# Altium project PCB_Project_IMX7.PrjPCB (part 9 of 9)
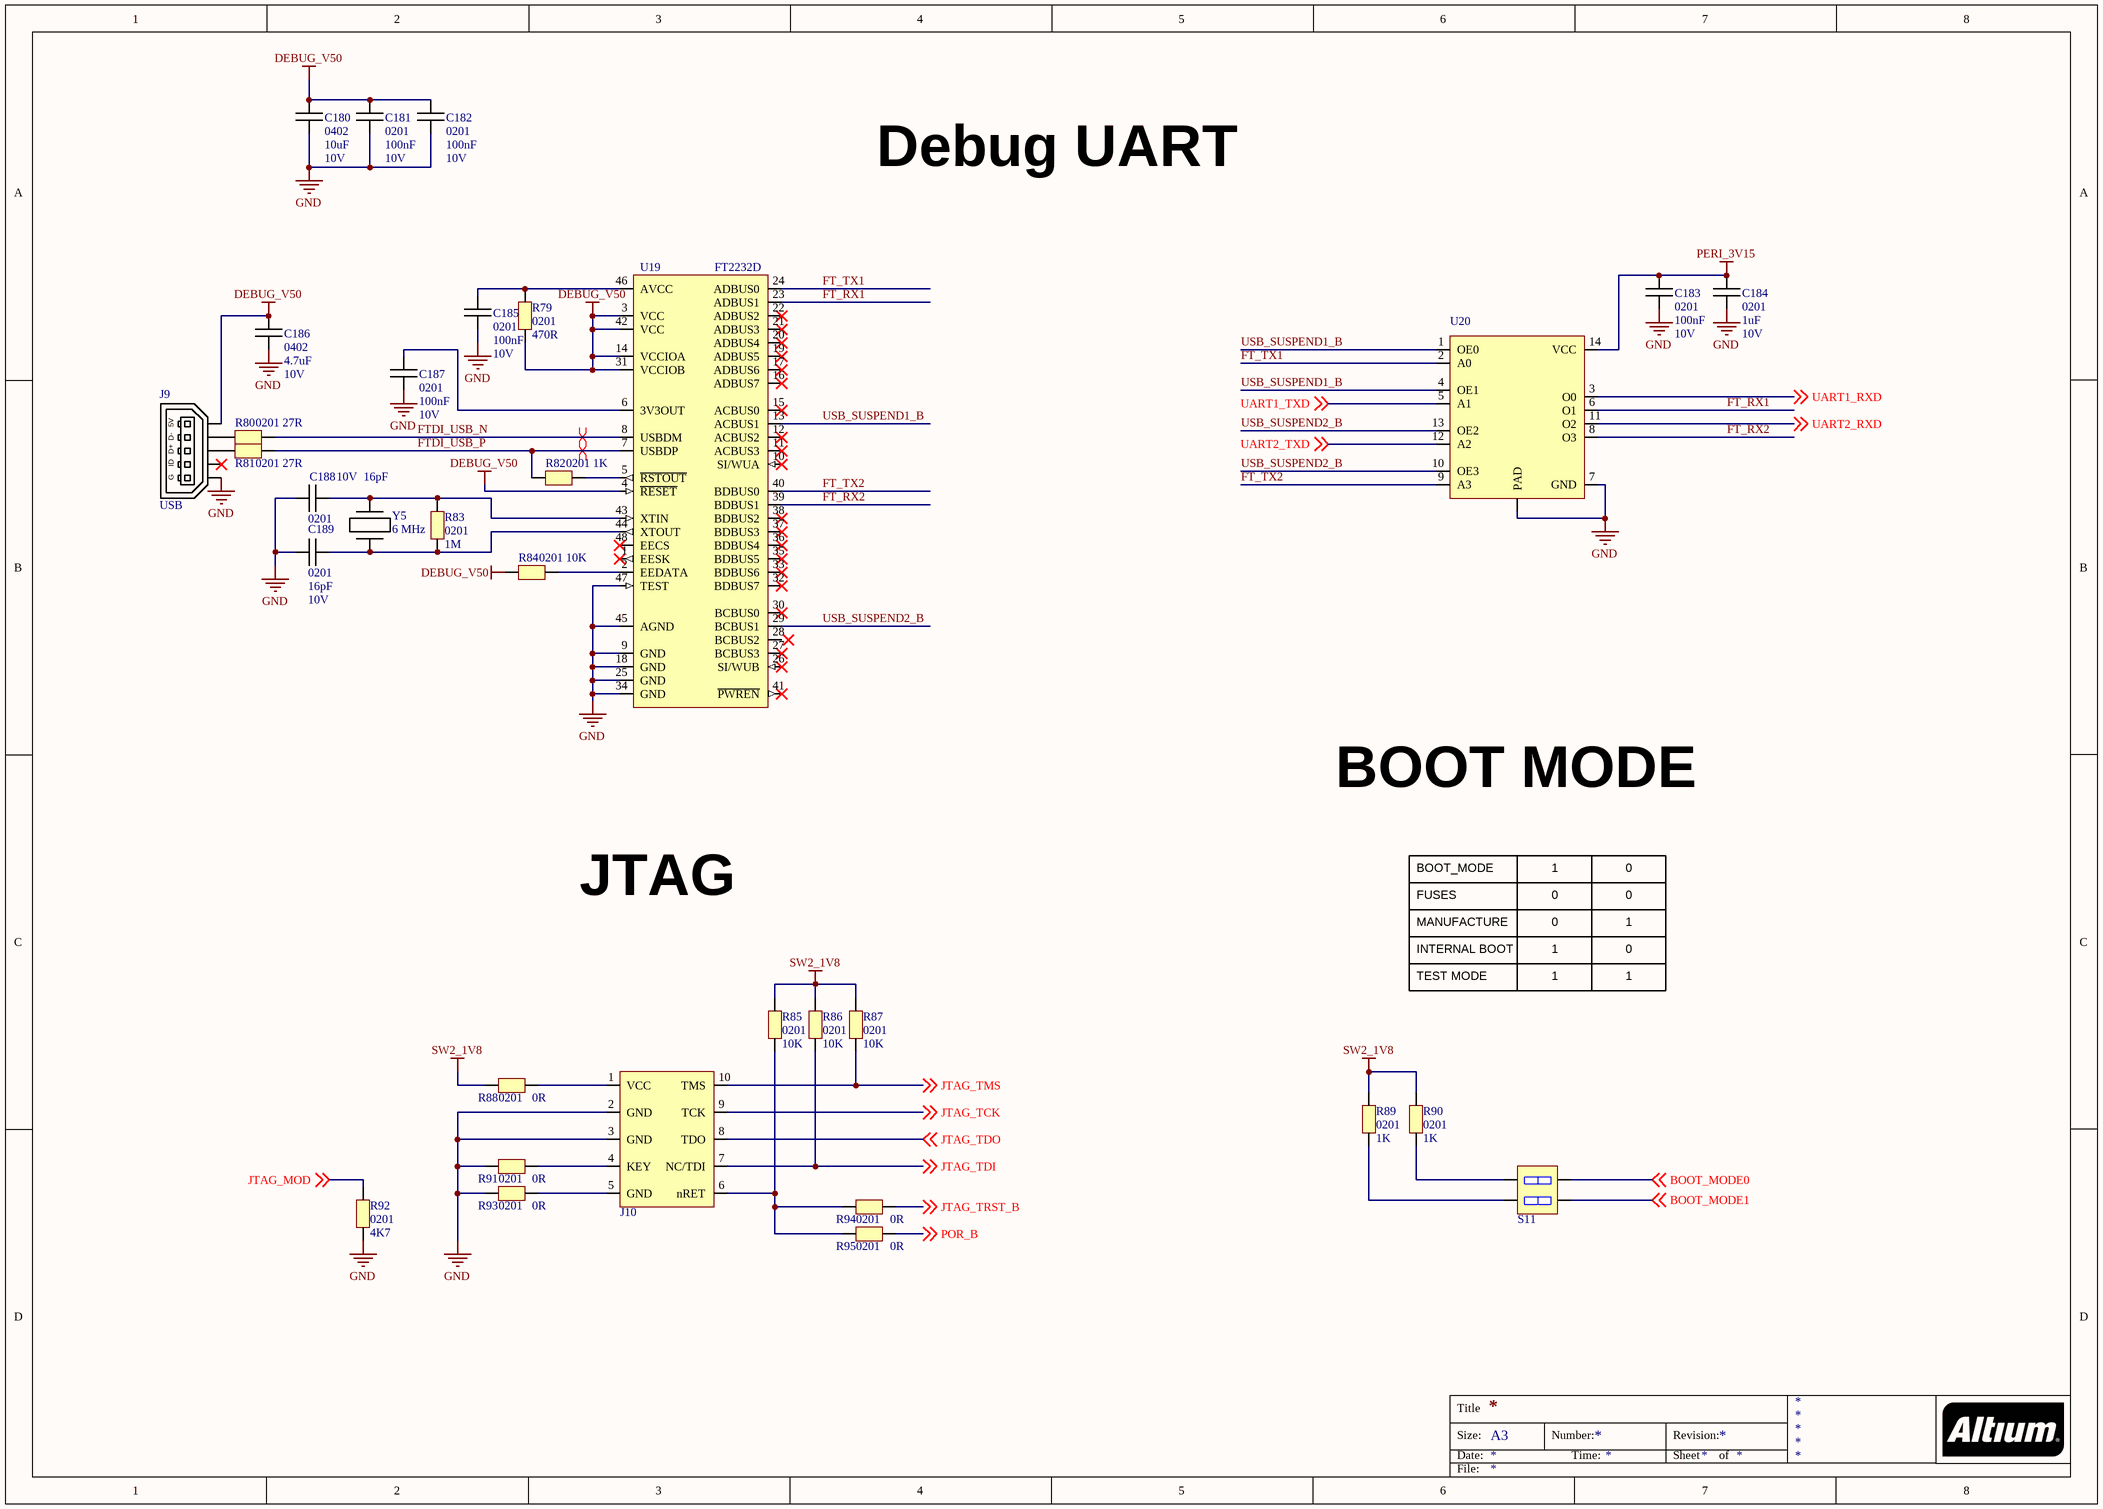
[diagram p12: IMX7S_DEBUG.SchDoc]

## Nets that join several sheets
DDR_VREF: IMX7S_PMIC (R34.2 R35.1), IMX7S_MEMORY (6 pins)
GND: IMX7S_PMIC (39 pins), IMX7S_CPU_POWER (123 pins), IMX7S_CPU_INTERFACES_1 (17 pins), IMX7S_CPU_INTERFACES_2 (11 pins), IMX7S_MEMORY (94 pins), IMX7S_WIRELESS (37 pins), IMX7S_CONNECTORS_&_IHM (34 pins), IMX7S_SENSORS_&_EXTERNAL_INTERFACES (43 pins), IMX7S_POWER (24 pins), IMX7S_DEBUG (24 pins)
NVCC_3V15: IMX7S_PMIC (C125.2 C135.2 U5.32 U5.47), IMX7S_CPU_INTERFACES_1 (12 pins), IMX7S_CPU_INTERFACES_2 (10 pins), IMX7S_MEMORY (7 pins), IMX7S_WIRELESS (7 pins)
NVCC_DRAM: IMX7S_PMIC (R34.1 R36.2), IMX7S_MEMORY (66 pins)
NVCC_SD2: IMX7S_PMIC (C122.2 U5.33), IMX7S_CPU_INTERFACES_1 (C21.2 U2.L9)
PERI_3V15: IMX7S_MEMORY (6 pins), IMX7S_WIRELESS (L6.2), IMX7S_CONNECTORS_&_IHM (41 pins), IMX7S_SENSORS_&_EXTERNAL_INTERFACES (35 pins), IMX7S_POWER (C167.1 L9.2 R63.2 TP6.1), IMX7S_DEBUG (C183.2 C184.2 U20.14)
PMIC_PWR: IMX7S_PMIC (17 pins), IMX7S_WIRELESS (C152.2 U14.30), IMX7S_POWER (C166.1 U17.2 U17.3)
SW2_1V8: IMX7S_PMIC (9 pins), IMX7S_CPU_POWER (C58.2 L1.1 U2.V9), IMX7S_MEMORY (9 pins), IMX7S_CONNECTORS_&_IHM (C1.2 U1.20), IMX7S_DEBUG (6 pins)
USB_OTG_VBUS: IMX7S_CPU_INTERFACES_2 (C27.2 U2.C9), IMX7S_POWER (10 pins)
VDD_ARM_SOC_IN: IMX7S_PMIC (R37.1 R38.1 U5.6), IMX7S_CPU_POWER (50 pins)
VDDA_1P8_IN: IMX7S_PMIC (R39.1), IMX7S_CPU_POWER (7 pins)
VLDO3_1V8: IMX7S_PMIC (C112.2 U5.20), IMX7S_CPU_POWER (R28.1 R29.1)
VSNVS: IMX7S_PMIC (C115.2 R42.2 U5.34), IMX7S_CPU_POWER (R27.1)
AUDIO_SAI1_MCLK: IMX7S_CPU_INTERFACES_1 (U2.D3), IMX7S_CONNECTORS_&_IHM (U1.13)
AUDIO_SAI1_RXD: IMX7S_CPU_INTERFACES_1 (U2.F3), IMX7S_CONNECTORS_&_IHM (U1.16)
AUDIO_SAI1_TXC: IMX7S_CPU_INTERFACES_1 (U2.F4), IMX7S_CONNECTORS_&_IHM (U1.15)
AUDIO_SAI1_TXD: IMX7S_CPU_INTERFACES_1 (U2.G5), IMX7S_CONNECTORS_&_IHM (U1.17)
AUDIO_SAI1_TXFS: IMX7S_CPU_INTERFACES_1 (U2.F5), IMX7S_CONNECTORS_&_IHM (U1.14)
BC3770_INT_B: IMX7S_CPU_INTERFACES_1 (U2.G2), IMX7S_POWER (R76.1 U18.B5)
BC3770_SHDN_B: IMX7S_CPU_INTERFACES_1 (U2.G1), IMX7S_POWER (U18.D3)
BNO055_BL_IND: IMX7S_CPU_INTERFACES_1 (U2.P27), IMX7S_SENSORS_&_EXTERNAL_INTERFACES (U13.10)
BNO055_INT: IMX7S_CPU_INTERFACES_1 (U2.T28), IMX7S_SENSORS_&_EXTERNAL_INTERFACES (U13.14)
BNO055_RST_B: IMX7S_CPU_INTERFACES_1 (U2.N28), IMX7S_SENSORS_&_EXTERNAL_INTERFACES (R49.1 U13.11)
BOOT_MODE0: IMX7S_CPU_INTERFACES_1 (U2.Y1), IMX7S_DEBUG (S11.4)
BOOT_MODE1: IMX7S_CPU_INTERFACES_1 (U2.Y2), IMX7S_DEBUG (S11.3)
BT_HOST_WAKE: IMX7S_CPU_INTERFACES_1 (U2.E1), IMX7S_WIRELESS (U14.38)
BT_REG_ON: IMX7S_CPU_INTERFACES_1 (U2.G3), IMX7S_WIRELESS (U14.14)
CAN_INT: IMX7S_CPU_INTERFACES_1 (U2.T26), IMX7S_SENSORS_&_EXTERNAL_INTERFACES (U9.12)
CAN_SPI4_MISO: IMX7S_CPU_INTERFACES_1 (U2.D20), IMX7S_CONNECTORS_&_IHM (MIKROBUS_4.5), IMX7S_SENSORS_&_EXTERNAL_INTERFACES (U9.14)
CAN_SPI4_MOSI: IMX7S_CPU_INTERFACES_1 (U2.G28), IMX7S_CONNECTORS_&_IHM (MIKROBUS_4.6), IMX7S_SENSORS_&_EXTERNAL_INTERFACES (U9.15)
CAN_SPI4_SCLK: IMX7S_CPU_INTERFACES_1 (U2.F25), IMX7S_CONNECTORS_&_IHM (MIKROBUS_4.4), IMX7S_SENSORS_&_EXTERNAL_INTERFACES (U9.13)
CAN_SPI4_SS: IMX7S_CPU_INTERFACES_1 (U2.N23), IMX7S_SENSORS_&_EXTERNAL_INTERFACES (U9.16)
CHARGE_EN_B: IMX7S_CPU_INTERFACES_1 (U2.F2), IMX7S_POWER (U18.D2)
CSI_CLK_N: IMX7S_CPU_INTERFACES_2 (U2.B16), IMX7S_CONNECTORS_&_IHM (J1.8)
CSI_CLK_P: IMX7S_CPU_INTERFACES_2 (U2.A16), IMX7S_CONNECTORS_&_IHM (J1.9)
CSI_D0_N: IMX7S_CPU_INTERFACES_2 (U2.B18), IMX7S_CONNECTORS_&_IHM (J1.2)
CSI_D0_P: IMX7S_CPU_INTERFACES_2 (U2.A18), IMX7S_CONNECTORS_&_IHM (J1.3)
CSI_D1_N: IMX7S_CPU_INTERFACES_2 (U2.B15), IMX7S_CONNECTORS_&_IHM (J1.5)
CSI_D1_P: IMX7S_CPU_INTERFACES_2 (U2.B14), IMX7S_CONNECTORS_&_IHM (J1.6)
CSI_GPIO0: IMX7S_CPU_INTERFACES_2 (U2.Y6), IMX7S_CONNECTORS_&_IHM (J1.11)
CSI_GPIO1: IMX7S_CPU_INTERFACES_2 (U2.Y5), IMX7S_CONNECTORS_&_IHM (J1.12)
DSI_CLK_N: IMX7S_CPU_INTERFACES_2 (U2.B24), IMX7S_CONNECTORS_&_IHM (J2.5)
DSI_CLK_P: IMX7S_CPU_INTERFACES_2 (U2.A24), IMX7S_CONNECTORS_&_IHM (J2.6)
DSI_D0_N: IMX7S_CPU_INTERFACES_2 (U2.B25), IMX7S_CONNECTORS_&_IHM (J2.8)
DSI_D0_P: IMX7S_CPU_INTERFACES_2 (U2.A25), IMX7S_CONNECTORS_&_IHM (J2.9)
DSI_D1_N: IMX7S_CPU_INTERFACES_2 (U2.A22), IMX7S_CONNECTORS_&_IHM (J2.2)
DSI_D1_P: IMX7S_CPU_INTERFACES_2 (U2.B22), IMX7S_CONNECTORS_&_IHM (J2.3)
I2C1_SCL: IMX7S_PMIC (U5.46), IMX7S_CPU_INTERFACES_2 (U2.N4), IMX7S_POWER (R75.1 U18.A4)
I2C1_SDA: IMX7S_PMIC (U5.45), IMX7S_CPU_INTERFACES_2 (U2.N5), IMX7S_POWER (R74.1 U18.A5)
I2C2_SCL: IMX7S_CPU_INTERFACES_2 (U2.N6), IMX7S_CONNECTORS_&_IHM (J1.13 J2.11)
I2C2_SDA: IMX7S_CPU_INTERFACES_2 (U2.N7), IMX7S_CONNECTORS_&_IHM (J1.14 J2.12)
I2C3_SCL: IMX7S_CPU_INTERFACES_2 (R19.1 U2.T6), IMX7S_CONNECTORS_&_IHM (MIKROBUS_1.12 MIKROBUS_2.12 MIKROBUS_3.12 MIKROBUS_4.12), IMX7S_SENSORS_&_EXTERNAL_INTERFACES (6 pins)
I2C3_SDA: IMX7S_CPU_INTERFACES_2 (R20.1 U2.T7), IMX7S_CONNECTORS_&_IHM (MIKROBUS_1.11 MIKROBUS_2.11 MIKROBUS_3.11 MIKROBUS_4.11), IMX7S_SENSORS_&_EXTERNAL_INTERFACES (6 pins)
I2C4_SCL: IMX7S_CPU_INTERFACES_2 (R21.1 U2.T5), IMX7S_CONNECTORS_&_IHM (U1.19)
I2C4_SDA: IMX7S_CPU_INTERFACES_2 (R22.1 U2.T4), IMX7S_CONNECTORS_&_IHM (U1.18)
JTAG_MOD: IMX7S_CPU_INTERFACES_1 (U2.AB1), IMX7S_DEBUG (R92.1)
JTAG_TCK: IMX7S_CPU_INTERFACES_1 (U2.AD1), IMX7S_DEBUG (J10.9)
JTAG_TDI: IMX7S_CPU_INTERFACES_1 (U2.AC2), IMX7S_DEBUG (J10.7 R86.2)
JTAG_TDO: IMX7S_CPU_INTERFACES_1 (U2.AE1), IMX7S_DEBUG (J10.8)
JTAG_TMS: IMX7S_CPU_INTERFACES_1 (U2.AD2), IMX7S_DEBUG (J10.10 R87.2)
JTAG_TRST_B: IMX7S_CPU_INTERFACES_1 (U2.AB2), IMX7S_DEBUG (R94.1)
MKBUS1_ADC_IN: IMX7S_CONNECTORS_&_IHM (MIKROBUS_1.1), IMX7S_SENSORS_&_EXTERNAL_INTERFACES (U6.1)
MKBUS1_INT: IMX7S_CPU_INTERFACES_1 (U2.D13), IMX7S_CONNECTORS_&_IHM (MIKROBUS_1.15)
MKBUS1_PWM: IMX7S_CPU_INTERFACES_1 (U2.E16), IMX7S_CPU_INTERFACES_2 (U2.AB3), IMX7S_CONNECTORS_&_IHM (MIKROBUS_1.16)
MKBUS1_RST: IMX7S_CPU_INTERFACES_2 (U2.AC6), IMX7S_CONNECTORS_&_IHM (MIKROBUS_1.2)
MKBUS2_ADC_IN: IMX7S_CONNECTORS_&_IHM (MIKROBUS_2.1), IMX7S_SENSORS_&_EXTERNAL_INTERFACES (U6.2)
MKBUS2_INT: IMX7S_CPU_INTERFACES_2 (U2.Y4), IMX7S_CONNECTORS_&_IHM (MIKROBUS_2.15)
MKBUS2_PWM: IMX7S_CPU_INTERFACES_2 (U2.AB4), IMX7S_CONNECTORS_&_IHM (MIKROBUS_2.16)
MKBUS2_RST: IMX7S_CPU_INTERFACES_2 (U2.AC5), IMX7S_CONNECTORS_&_IHM (MIKROBUS_2.2)
MKBUS3_ADC_IN: IMX7S_CONNECTORS_&_IHM (MIKROBUS_3.1), IMX7S_SENSORS_&_EXTERNAL_INTERFACES (U6.3)
MKBUS3_INT: IMX7S_CPU_INTERFACES_2 (U2.V6), IMX7S_CONNECTORS_&_IHM (MIKROBUS_3.15)
MKBUS3_PWM: IMX7S_CPU_INTERFACES_2 (U2.AB5), IMX7S_CONNECTORS_&_IHM (MIKROBUS_3.16)
MKBUS3_RST: IMX7S_CPU_INTERFACES_2 (U2.AC4), IMX7S_CONNECTORS_&_IHM (MIKROBUS_3.2)
MKBUS4_ADC_IN: IMX7S_CONNECTORS_&_IHM (MIKROBUS_4.1), IMX7S_SENSORS_&_EXTERNAL_INTERFACES (U6.4)
MKBUS4_INT: IMX7S_CPU_INTERFACES_2 (U2.V7), IMX7S_CONNECTORS_&_IHM (MIKROBUS_4.15)
MKBUS4_PWM: IMX7S_CPU_INTERFACES_2 (U2.AB6), IMX7S_CONNECTORS_&_IHM (MIKROBUS_4.16)
MKBUS4_RST: IMX7S_CPU_INTERFACES_2 (U2.AC3), IMX7S_CONNECTORS_&_IHM (MIKROBUS_4.2)
MKBUS_ESPI3_MISO: IMX7S_CPU_INTERFACES_2 (U2.P2), IMX7S_CONNECTORS_&_IHM (MIKROBUS_1.5 MIKROBUS_2.5 MIKROBUS_3.5)
MKBUS_ESPI3_MOSI: IMX7S_CPU_INTERFACES_2 (U2.N1), IMX7S_CONNECTORS_&_IHM (MIKROBUS_1.6 MIKROBUS_2.6 MIKROBUS_3.6)
MKBUS_ESPI3_SCLK: IMX7S_CPU_INTERFACES_2 (U2.N2), IMX7S_CONNECTORS_&_IHM (MIKROBUS_1.4 MIKROBUS_2.4 MIKROBUS_3.4)
MKBUS_SPI4_SS0: IMX7S_CPU_INTERFACES_1 (U2.R27), IMX7S_CONNECTORS_&_IHM (MIKROBUS_4.3)
MKBUS_SS0: IMX7S_CPU_INTERFACES_2 (U2.N3), IMX7S_CONNECTORS_&_IHM (MIKROBUS_1.3)
MKBUS_SS1: IMX7S_CPU_INTERFACES_1 (U2.E11), IMX7S_CONNECTORS_&_IHM (MIKROBUS_2.3)
MKBUS_SS2: IMX7S_CPU_INTERFACES_1 (U2.F11), IMX7S_CONNECTORS_&_IHM (MIKROBUS_3.3)
MKBUS_UART5_RXD: IMX7S_CPU_INTERFACES_2 (U2.L3), IMX7S_CONNECTORS_&_IHM (MIKROBUS_1.14 MIKROBUS_2.14)
MKBUS_UART5_TXD: IMX7S_CPU_INTERFACES_2 (U2.K2), IMX7S_CONNECTORS_&_IHM (MIKROBUS_1.13 MIKROBUS_2.13)
MKBUS_UART7_RXD: IMX7S_CPU_INTERFACES_1 (U2.M26), IMX7S_CONNECTORS_&_IHM (MIKROBUS_3.14 MIKROBUS_4.14)
MKBUS_UART7_TXD: IMX7S_CPU_INTERFACES_1 (U2.L26), IMX7S_CONNECTORS_&_IHM (MIKROBUS_3.13 MIKROBUS_4.13)
MX7_ONOFF: IMX7S_CPU_INTERFACES_1 (U2.AD13), IMX7S_CONNECTORS_&_IHM (C5.2 S1.3 S1.4)
PCM_CLK: IMX7S_CPU_INTERFACES_1 (U2.D4), IMX7S_WIRELESS (U14.11)
PCM_IN: IMX7S_CPU_INTERFACES_1 (U2.D6), IMX7S_WIRELESS (U14.9)
PCM_OUT: IMX7S_CPU_INTERFACES_1 (U2.E6), IMX7S_WIRELESS (U14.10)
PCM_SYNC: IMX7S_CPU_INTERFACES_1 (U2.F6), IMX7S_WIRELESS (U14.8)
PMIC_INT_B: IMX7S_PMIC (R40.1 U5.1), IMX7S_CPU_INTERFACES_2 (U2.Y7)
PMIC_ON_REQ: IMX7S_PMIC (R42.1 R43.2 U5.48), IMX7S_CPU_INTERFACES_1 (U2.AE13)
PMIC_PWRON: IMX7S_PMIC (R43.1), IMX7S_CONNECTORS_&_IHM (C8.2 R2.1 R3.2)
PMIC_SD_VSEL: IMX7S_PMIC (U5.2), IMX7S_CPU_INTERFACES_1 (U2.E2)
POR_B: IMX7S_PMIC (R41.1 U5.3), IMX7S_CPU_INTERFACES_1 (U2.Y3), IMX7S_CPU_INTERFACES_2 (R24.1), IMX7S_CONNECTORS_&_IHM (R2.2), IMX7S_DEBUG (R95.1)
RST_SIGFOX: IMX7S_CPU_INTERFACES_1 (U2.N25), IMX7S_WIRELESS (U16.25)
SD1_CLK: IMX7S_CPU_INTERFACES_1 (U2.B3), IMX7S_WIRELESS (U14.20)
SD1_CMD: IMX7S_CPU_INTERFACES_1 (U2.A2), IMX7S_WIRELESS (R55.1 U14.22)
SD1_DATA0: IMX7S_CPU_INTERFACES_1 (U2.B4), IMX7S_WIRELESS (R51.1 U14.24)
SD1_DATA1: IMX7S_CPU_INTERFACES_1 (U2.A4), IMX7S_WIRELESS (R52.1 U14.26)
SD1_DATA2: IMX7S_CPU_INTERFACES_1 (U2.B2), IMX7S_WIRELESS (R53.1 U14.23)
SD1_DATA3: IMX7S_CPU_INTERFACES_1 (U2.B1), IMX7S_WIRELESS (R54.1 U14.25)
SD3_CLK: IMX7S_CPU_INTERFACES_1 (U2.J6), IMX7S_MEMORY (U4.M6)
SD3_CMD: IMX7S_CPU_INTERFACES_1 (U2.L4), IMX7S_MEMORY (U4.M5)
SD3_DATA0: IMX7S_CPU_INTERFACES_1 (U2.G6), IMX7S_MEMORY (U4.A3)
SD3_DATA1: IMX7S_CPU_INTERFACES_1 (U2.G7), IMX7S_MEMORY (U4.A4)
SD3_DATA2: IMX7S_CPU_INTERFACES_1 (U2.L7), IMX7S_MEMORY (U4.A5)
SD3_DATA3: IMX7S_CPU_INTERFACES_1 (U2.L6), IMX7S_MEMORY (U4.B2)
SD3_DATA4: IMX7S_CPU_INTERFACES_1 (U2.L5), IMX7S_MEMORY (U4.B3)
SD3_DATA5: IMX7S_CPU_INTERFACES_1 (U2.J7), IMX7S_MEMORY (U4.B4)
SD3_DATA6: IMX7S_CPU_INTERFACES_1 (U2.J5), IMX7S_MEMORY (U4.B5)
SD3_DATA7: IMX7S_CPU_INTERFACES_1 (U2.J4), IMX7S_MEMORY (U4.B6)
SD3_RESET_B: IMX7S_CPU_INTERFACES_1 (U2.J2), IMX7S_MEMORY (U4.K5)
SD3_STROBE: IMX7S_CPU_INTERFACES_1 (U2.J1), IMX7S_MEMORY (U4.H5)
UART1_RXD: IMX7S_CPU_INTERFACES_2 (U2.T1), IMX7S_DEBUG (U20.3)
UART1_TXD: IMX7S_CPU_INTERFACES_2 (U2.V1), IMX7S_DEBUG (U20.5)
UART2_RXD: IMX7S_CPU_INTERFACES_2 (U2.T2), IMX7S_DEBUG (U20.11)
UART2_TXD: IMX7S_CPU_INTERFACES_2 (U2.T3), IMX7S_DEBUG (U20.12)
UART3_CTS: IMX7S_CPU_INTERFACES_2 (U2.V3), IMX7S_WIRELESS (U14.4)
UART3_RTS: IMX7S_CPU_INTERFACES_2 (U2.W2), IMX7S_WIRELESS (U14.5)
UART3_RXD: IMX7S_CPU_INTERFACES_2 (U2.V2), IMX7S_WIRELESS (U14.3)
UART3_TXD: IMX7S_CPU_INTERFACES_2 (U2.U3), IMX7S_WIRELESS (U14.2)
UART6_RXD: IMX7S_CPU_INTERFACES_1 (U2.N27), IMX7S_WIRELESS (U16.20)
UART6_TXD: IMX7S_CPU_INTERFACES_1 (U2.N26), IMX7S_WIRELESS (U16.21)
USB_OTG1_N: IMX7S_CPU_INTERFACES_2 (U2.B7), IMX7S_POWER (L11.2)
USB_OTG1_P: IMX7S_CPU_INTERFACES_2 (U2.A7), IMX7S_POWER (L11.3)
USB_OTG_ID: IMX7S_CPU_INTERFACES_2 (U2.B9), IMX7S_POWER (D26.3 J7.4)
USER_BP0: IMX7S_CPU_INTERFACES_1 (U2.F22), IMX7S_CONNECTORS_&_IHM (S3.3 S3.4)
USER_BP1: IMX7S_CPU_INTERFACES_1 (U2.F23), IMX7S_CONNECTORS_&_IHM (S4.3 S4.4)
USER_BP2: IMX7S_CPU_INTERFACES_1 (U2.E23), IMX7S_CONNECTORS_&_IHM (S5.3 S5.4)
USER_BP3: IMX7S_CPU_INTERFACES_1 (U2.E22), IMX7S_CONNECTORS_&_IHM (S6.3 S6.4)
USER_BP4: IMX7S_CPU_INTERFACES_1 (U2.D22), IMX7S_CONNECTORS_&_IHM (S7.3 S7.4)
USER_BP5: IMX7S_CPU_INTERFACES_1 (U2.D23), IMX7S_CONNECTORS_&_IHM (S8.3 S8.4)
USER_BP6: IMX7S_CPU_INTERFACES_1 (U2.E18), IMX7S_CONNECTORS_&_IHM (S9.3 S9.4)
USER_BP7: IMX7S_CPU_INTERFACES_1 (U2.D18), IMX7S_CONNECTORS_&_IHM (S10.3 S10.4)
USER_LED_0: IMX7S_CPU_INTERFACES_1 (U2.F20), IMX7S_CONNECTORS_&_IHM (D2.2)
USER_LED_1: IMX7S_CPU_INTERFACES_1 (U2.G20), IMX7S_CONNECTORS_&_IHM (D3.2)
USER_LED_2: IMX7S_CPU_INTERFACES_1 (U2.A27), IMX7S_CONNECTORS_&_IHM (D4.2)
USER_LED_3: IMX7S_CPU_INTERFACES_1 (U2.E27), IMX7S_CONNECTORS_&_IHM (D5.2)
USER_LED_4: IMX7S_CPU_INTERFACES_1 (U2.F27), IMX7S_CONNECTORS_&_IHM (D6.2)
USER_LED_5: IMX7S_CPU_INTERFACES_1 (U2.E28), IMX7S_CONNECTORS_&_IHM (D7.2)
USER_LED_6: IMX7S_CPU_INTERFACES_1 (U2.G27), IMX7S_CONNECTORS_&_IHM (D8.2)
USER_LED_7: IMX7S_CPU_INTERFACES_1 (U2.B28), IMX7S_CONNECTORS_&_IHM (D9.2)
USER_LED_8: IMX7S_CPU_INTERFACES_1 (U2.C27), IMX7S_CONNECTORS_&_IHM (D1.20)
USER_LED_9: IMX7S_CPU_INTERFACES_1 (U2.D26), IMX7S_CONNECTORS_&_IHM (D1.19)
USER_LED_10: IMX7S_CPU_INTERFACES_1 (U2.D27), IMX7S_CONNECTORS_&_IHM (D1.18)
USER_LED_11: IMX7S_CPU_INTERFACES_1 (U2.D28), IMX7S_CONNECTORS_&_IHM (D1.17)
USER_LED_12: IMX7S_CPU_INTERFACES_1 (U2.G26), IMX7S_CONNECTORS_&_IHM (D1.16)
USER_LED_13: IMX7S_CPU_INTERFACES_1 (U2.H26), IMX7S_CONNECTORS_&_IHM (D1.15)
USER_LED_14: IMX7S_CPU_INTERFACES_1 (U2.B27), IMX7S_CONNECTORS_&_IHM (D1.14)
USER_LED_15: IMX7S_CPU_INTERFACES_1 (U2.D25), IMX7S_CONNECTORS_&_IHM (D1.13)
USER_LED_16: IMX7S_CPU_INTERFACES_1 (U2.T27), IMX7S_CONNECTORS_&_IHM (D1.12)
USER_LED_17: IMX7S_CPU_INTERFACES_1 (U2.U26), IMX7S_CONNECTORS_&_IHM (D1.11)
WL_HOST_WAKE: IMX7S_CPU_INTERFACES_1 (U2.J3), IMX7S_WIRELESS (U14.27)
WL_REG_ON: IMX7S_CPU_INTERFACES_1 (U2.D1), IMX7S_WIRELESS (U14.28)